# Altium schematic sheet MCU .SchDoc
size A4
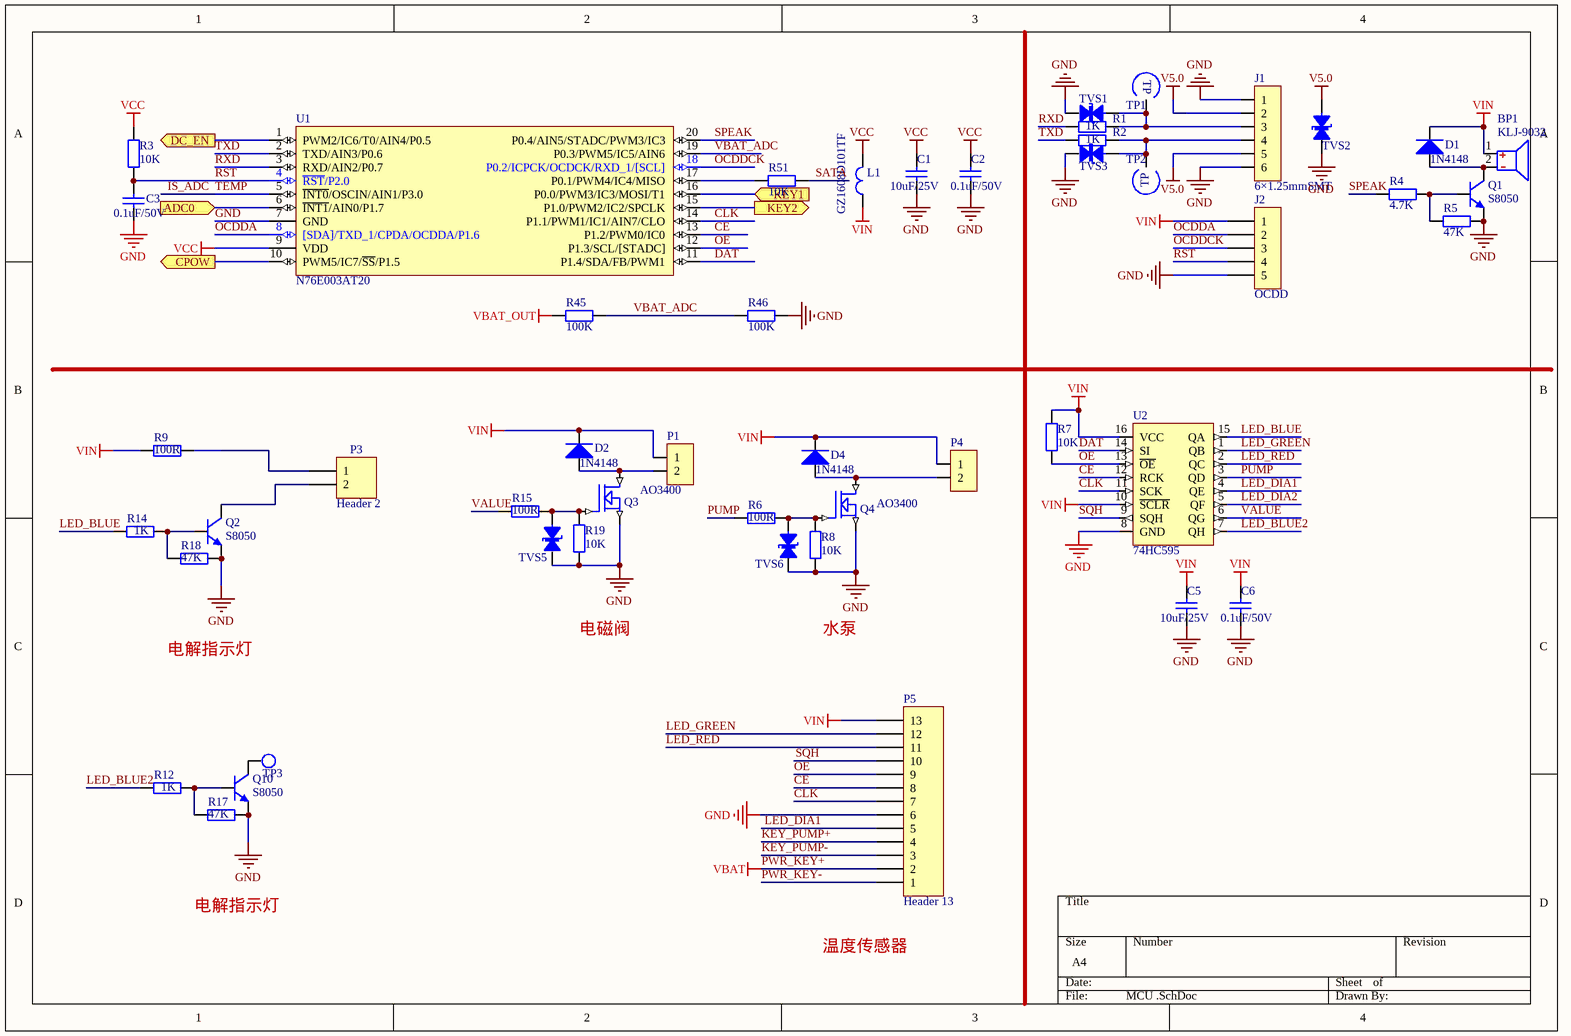
[diagram p0: MCU .SchDoc]

## Parts
BP1  KLJ-9032  [SP9025]
C1  10uF/25V  [SMD-0603C]
C2  0.1uF/50V  [SMD-0603C]
C3  0.1uF/50V  [SMD-0603C]
C5  10uF/25V  [SMD-0603C]
C6  0.1uF/50V  [SMD-0603C]
D1  1N4148  [SOD-123]
D2  1N4148  [SOD-123]
D4  1N4148  [SOD-123]
J1  6×1.25mmSMT  [6×1.25mmSMT]
J2  OCDD  [sip-5]
L1  GZ1608D101TF  [SMD-0603]
P1  (no value)  [2*2.54mmSMT]
P3  Header 2  [2X2.54MMZ]
P4  (no value)  [2*2.54mmSMT]
P5  Header 13  [13×1.25mmSMT]
Q1  S8050  [SOT-23]
Q2  S8050  [SOT-23]
Q3  AO3400  [SOT-23]
Q4  AO3400  [SOT-23]
Q10  S8050  [SOT-23]
R1  1K  [SMD-0603]
R2  1K  [SMD-0603]
R3  10K  [SMD-0603]
R4  4.7K  [SMD-0603]
R5  47K  [SMD-0603]
R6  100R  [SMD-0603]
R7  10K  [SMD-0603]
R8  10K  [SMD-0603]
R9  100R  [SMD-0805]
R12  1K  [SMD-0603]
R14  1K  [SMD-0603]
R15  100R  [SMD-0603]
R17  47K  [SMD-0603]
R18  47K  [SMD-0603]
R19  10K  [SMD-0603]
R45  100K  [SMD-0603]
R46  100K  [SMD-0603]
R51  10K  [SMD-0603]
TP1  testpoint  [TP]  (value not drawn)
TP2  testpoint  [TP]  (value not drawn)
TP3  TPS  [HOLE]  (value not drawn)
TVS1  ESD5Z5.0CT1G  [SOD-523]  (value not drawn)
TVS2  SMF5.0CA  [SOD-123]  (value not drawn)
TVS3  ESD5Z5.0CT1G  [SOD-523]  (value not drawn)
TVS5  ESD5Z5.0CT1G  [SOD-523]  (value not drawn)
TVS6  ESD5Z5.0CT1G  [SOD-523]  (value not drawn)
U1  N76E003AT20  [TSSOP20]
U2  74HC595  [SSOP-16]

## Ports
ADC0 (in), CPOW (out), DC_EN (out), KEY1 (in), KEY2 (out)

## Nets
GND: C1.1 C2.1 C3.2 C5.1 C6.1 J1.1 J1.6 J2.5 P5.6 Q1.2(E) Q2.2(E) Q3.2(S) Q4.2(S) Q10.2(E) R5.2 R8.1 R17.2 R18.2 R19.1 R46.2 TVS1.1(A) TVS2.1(A) TVS3.1(A) TVS5.1(A) TVS6.1(A) U1.7(GND) U2.8(GND)
PWR_KEY+: P5.2  [also labelled VBAT]
V5.0: J1.2 J1.5 TVS2.2(B)
VBAT_OUT: R45.1
VCC: C1.2 C2.2 L1.2 R3.1 U1.9(VDD)
VIN: BP1.1(VCC) C5.2 C6.2 D1.2(K) D2.2(K) D4.2(K) J2.1 L1.1 P1.1 P4.1 P5.13 R7.2 R9.2 U2.10(~{SCLR}) U2.16(VCC)
ADC0: U1.6(~{INT1}/AIN0/P1.7) ; port ADC0
CE: P5.8 U1.13(P1.2/PWM0/IC0) U2.12(RCK)
CLK: P5.7 U1.14(P1.1/PWM1/IC1/AIN7/CLO) U2.11(SCK)
CPOW: U1.10(PWM5/IC7/~{SS}/P1.5) ; port CPOW
DAT: U1.11(P1.4/SDA/FB/PWM1) U2.14(SI)
DC_EN: U1.1(PWM2/IC6/T0/AIN4/P0.5) ; port DC_EN
IS_ADC: U1.5(~{INT0}/OSCIN/AIN1/P3.0)  [also labelled TEMP]
KEY1: U1.16(P0.0/PWM3/IC3/MOSI/T1) ; port KEY1
KEY2: U1.15(P1.0/PWM2/IC2/SPCLK) ; port KEY2
KEY_PUMP+: P5.4
KEY_PUMP-: P5.3
LED_BLUE: R14.1 U2.15(QA)
LED_BLUE2: R12.1 U2.7(QH)
LED_DIA1: P5.5 U2.4(QE)
LED_DIA2: U2.5(QF)
LED_GREEN: P5.12 U2.1(QB)
LED_RED: P5.11 U2.2(QC)
OCDDA: J2.2 U1.8([SDA]/TXD_1/CPDA/OCDDA/P1.6)
OCDDCK: J2.3 U1.18(P0.2/ICPCK/OCDCK/RXD_1/[SCL])
OE: P5.9 R7.1 U1.12(P1.3/SCL/[STADC]) U2.13(~{OE})
PUMP: R6.1 U2.3(QD)
PWR_KEY-: P5.1
RST: C3.1 J2.4 R3.2 U1.4(~{RST}/P2.0)
RXD: R1.2 U1.3(RXD/AIN2/P0.7)
SATA: R51.2
SPEAK: R4.1 U1.20(P0.4/AIN5/STADC/PWM3/IC3)
SQH: P5.10 U2.9(SQH)
TXD: R2.2 U1.2(TXD/AIN3/P0.6)
VALUE: R15.1 U2.6(QG)
VBAT_ADC: R45.2 R46.1 U1.19(P0.3/PWM5/IC5/AIN6)
NetBP1_2: BP1.2 D1.1(A) Q1.3(C)
NetD2_1: D2.1(A) P1.2 Q3.3(D)
NetD4_1: D4.1(A) P4.2 Q4.3(D)
NetJ1_3: J1.3 R1.1 TP1.1 TVS1.2(B)
NetJ1_4: J1.4 R2.1 TP2.1 TVS3.2(B)
NetP3_1: P3.1 R9.1
NetP3_2: P3.2 Q2.3(C)
NetQ1_1: Q1.1(B) R4.2 R5.1
NetQ2_1: Q2.1(B) R14.2 R18.1
NetQ3_1: Q3.1(G) R15.2 R19.2 TVS5.2(B)
NetQ4_1: Q4.1(G) R6.2 R8.2 TVS6.2(B)
NetQ10_1: Q10.1(B) R12.2 R17.1
NetQ10_3: Q10.3(C) TP3.1
NetR51_1: R51.1 U1.17(P0.1/PWM4/IC4/MISO)

## Notes on the sheet
- 电解指示灯
- 电磁阀
- 水泵
- 温度传感器
- (in symbol TP-1) TP

## Library data of the parts
BP1 = SPEAKER: 无源蜂鸣器 3.3V 频率2731
C1-C3 C5 C6 = CAP4: 贴片电容 10%
D1 D2 D4 = DIODE2: 小封装二极管
J1 = SIP-6: USB 3.1 Type-C 2.0短体母座 6P贴片式
J2 = SIP-5: 下载口(NC)
L1 = CIZHU1: 贴片磁珠100R 100M
P1 P4 = SIP-2: 间距2.0mm 立贴 2Pin
P3 = Header 2: Header, 2-Pin; LatestRevisionDate: 17-Jul-2002; LatestRevisionNote: Re-released for DXP Platform.; Publisher: Altium Limited
P5 = Header 13: Header, 13-Pin; LatestRevisionDate: 17-Jul-2002; LatestRevisionNote: Re-released for DXP Platform.; Publisher: Altium Limited
Q1 Q2 Q10 = NPN-1: NPN
Q3 Q4 = MOSFET N
R1-R9 R12 R14 R15 R17-R19 R45 R46 R51 = RES0: 贴片电阻 5%
TP1 TP2 = TP-1: 测试点
TVS1-TVS3 TVS5 TVS6 = TVS-1: ESD二极管
U1 = N76E003AT20: 新唐MCU
U2 = 74HC595: 逻辑IC